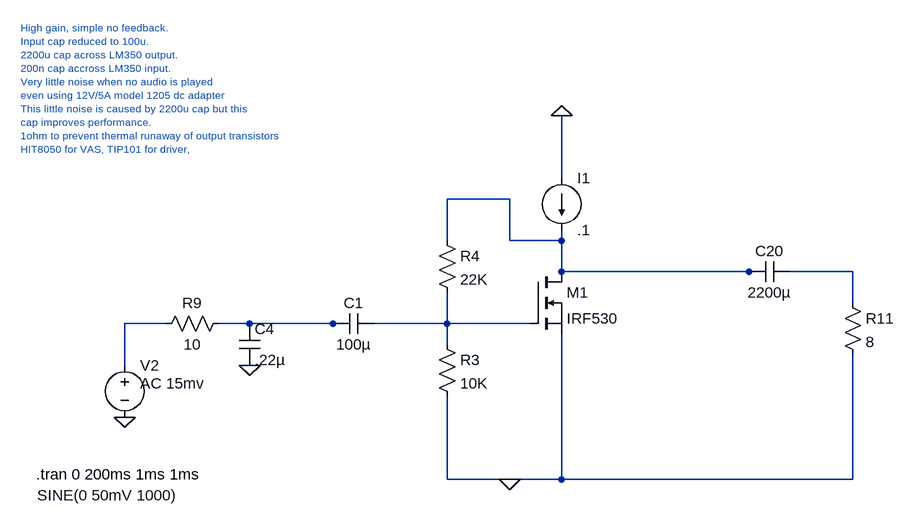
[diagram p0: schematic Zen amp.asc]
Zen amp.asc, the LTspice schematic file:
Version 4
SHEET 1 1788 680
WIRE 224 -112 224 -208
WIRE 144 -80 48 -80
WIRE 48 -16 48 -80
WIRE 144 -16 144 -80
WIRE 224 -16 224 -32
WIRE 224 -16 144 -16
WIRE 224 32 224 -16
WIRE 512 32 224 32
WIRE 528 32 512 32
WIRE 672 32 576 32
WIRE 672 80 672 32
WIRE -384 112 -448 112
WIRE -256 112 -304 112
WIRE -128 112 -256 112
WIRE -112 112 -128 112
WIRE 48 112 48 64
WIRE 48 112 -64 112
WIRE 176 112 48 112
WIRE 48 144 48 112
WIRE -448 176 -448 112
WIRE 48 352 48 224
WIRE 144 352 48 352
WIRE 224 352 224 128
WIRE 224 352 144 352
WIRE 672 352 672 160
WIRE 672 352 224 352
FLAG 144 352 0
FLAG -448 256 0
FLAG -256 176 0
FLAG 224 -208 0
SYMBOL res 32 -32 R0
SYMATTR InstName R4
SYMATTR Value 22K
SYMBOL res 32 128 R0
SYMATTR InstName R3
SYMATTR Value 10K
SYMBOL cap -64 96 R90
WINDOW 0 0 32 VBottom 2
WINDOW 3 32 32 VTop 2
SYMATTR InstName C1
SYMATTR Value 100µ
SYMBOL voltage -448 160 R0
WINDOW 123 24 44 Left 2
WINDOW 39 24 72 Left 2
WINDOW 3 -135 216 Left 2
SYMATTR Value2 AC 15mv
SYMATTR Value SINE(0 50mV 1000)
SYMATTR InstName V2
SYMBOL res 656 64 R0
SYMATTR InstName R11
SYMATTR Value 8
SYMBOL cap 576 16 R90
WINDOW 0 0 32 VBottom 2
WINDOW 3 32 32 VTop 2
SYMATTR InstName C20
SYMATTR Value 2200µ
SYMBOL res -288 96 R90
WINDOW 0 0 56 VBottom 2
WINDOW 3 32 56 VTop 2
SYMATTR InstName R9
SYMATTR Value 10
SYMBOL cap -272 112 R0
SYMATTR InstName C4
SYMATTR Value .22µ
SYMBOL current 224 -112 R0
WINDOW 123 0 0 Left 2
WINDOW 39 0 0 Left 2
SYMATTR InstName I1
SYMATTR Value .1
SYMBOL nmos 176 32 R0
SYMATTR InstName M1
SYMATTR Value IRF530
TEXT -584 344 Left 2 !.tran 0 200ms 1ms 1ms
TEXT -608 -344 Left 1 ;High gain, simple no feedback.\nInput cap reduced to 100u.\n2200u cap across LM350 output.\n200n cap accross LM350 input.\nVery little noise when no audio is played\neven using 12V/5A model 1205 dc adapter\nThis little noise is caused by 2200u cap but this\ncap improves performance.\n1ohm to prevent thermal runaway of output transistors\nHIT8050 for VAS, TIP101 for driver,

The netlist it stands for:
* Zen amp.asc
R4 N001 N005 22K
R3 N005 0 10K
C1 N005 N004 100µ
V2 N003 0 SINE(0 50mV 1000) AC 15mv
R11 N002 0 8
C20 N002 N001 2200µ
R9 N004 N003 10
C4 N004 0 .22µ
I1 0 N001 .1
M1 N001 N005 0 0 IRF530
.model NMOS NMOS
.model PMOS PMOS
.lib standard.mos
.tran 0 200ms 1ms 1ms
* High gain, simple no feedback.
* Input cap reduced to 100u.
* 2200u cap across LM350 output.
* 200n cap accross LM350 input.
* Very little noise when no audio is played
* even using 12V/5A model 1205 dc adapter
* This little noise is caused by 2200u cap but this
* cap improves performance.
* 1ohm to prevent thermal runaway of output transistors
* HIT8050 for VAS, TIP101 for driver,
.backanno
.end